# EAGLE design CAN module (EAGLE 8.1.1)
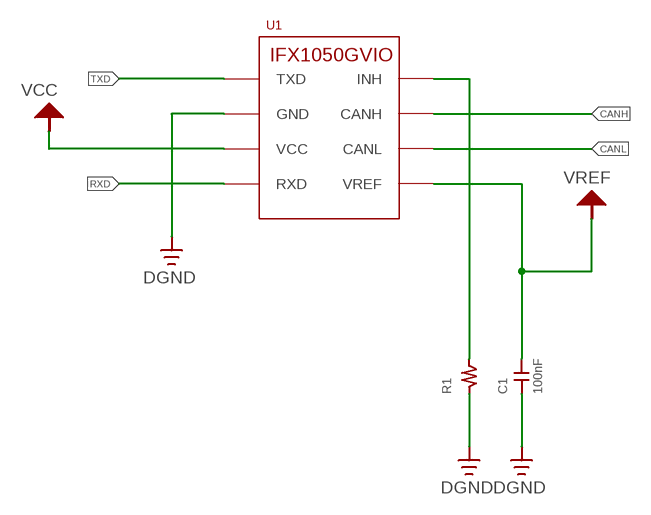
[diagram p0: schematic, sheet 1]

## Parts
C1  100nF  CAPACITOR_CHIP2012  [2012]
R1  RESISTOR_CHIP_2012  [2012]
U1  IFX1050GVIO  [PG-DSO-8]

## Nets
CANH: U1.P7(CANH)
CANL: U1.P6(CANL)
DGND: C1.P$1 R1.P$1 U1.P2(GND)
N$3: R1.P$2 U1.P8(INH)
RXD: U1.P4(RXD)
TXD: U1.P1(TXD)
VCC: U1.P3(VCC)
VREF: C1.P$2 U1.P5(VREF)

## Library data of the parts
C1 = passive:CAPACITOR_CHIP
R1 = passive:RESISTOR_CHIP_
U1 = CAN:IFX1050GVIO: The HS CAN-transceiver IFX1050GVIO is optimized for high speed differential mode data transmission in industrial applications and is compatible to ISO/DIS 11898. It works as an interface between the CAN protocol controller and the physical differential bus in both, 12 V and 24 V systems. The IFX1050GVIO is designed to withstand the conditions of industrial applications and provides excellent EMC performance.

## Board
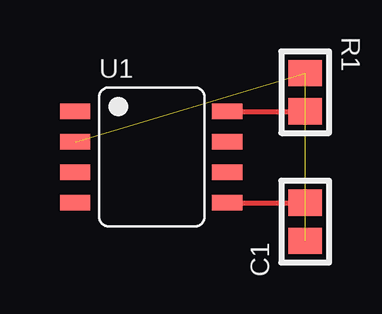
[diagram p1: board, top side]

No outline drawn. Coordinates in mm, seen from the top.
Copper layers (1*16): Top 0.035mm / dielectric 1.5mm / Bottom 0.035mm
Design rules "default": minimum track width 10mil, minimum drill 24mil, track to track 8mil, track to pad 8mil, pad to pad 8mil, via to via 8mil, smd to smd 8mil, copper to edge 40mil, drill to drill 8mil, minimum pad ring 10mil, minimum via ring 8mil, stop-mask expansion 4mil, vias tented up to drill 0mil, thermal gap 10mil

### Footprints (pad centres in the part's own frame; a part is rotated, then mirrored left to right if it is on the bottom)
2012 = smd 1.4 x 1.1: P$1 0,0.8; P$2 0,-0.8
PG-DSO-8 = smd 1.27 x 0.635: P1 0,0; P2 0,-1.27; P3 0,-2.54; P4 0,-3.81; P5 6.35,-3.81; P6 6.35,-2.54; P7 6.35,-1.27; P8 6.35,0

### Placement (x,y rotation side)
C1  12.1,-7.1 180 top
R1  12.1,-1.7 0 top
U1  2.5,-2.5 0 top

### Tracks (layer width: path | path; a pad name or v marks a point on that pad's centre or on a via)
DGND  (2 unrouted)
N$3
  Top 0.2: U1.P8 R1.P$2
VREF
  Top 0.2: U1.P5 C1.P$2